# EAGLE design BackscatterPlantSensor_v4_trimmer (EAGLE 6.4)

## Sheet 1 of 3
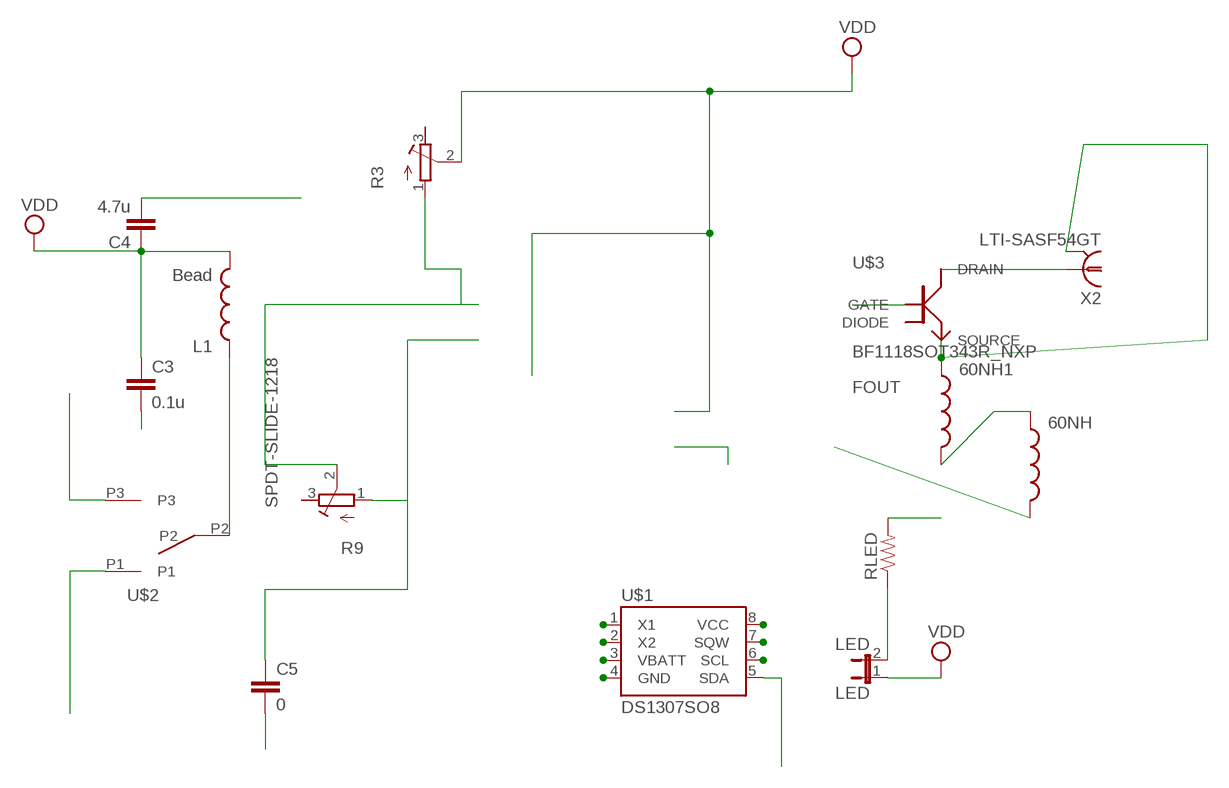
[diagram p0: schematic, sheet 1]

### Parts
60NH  INDUCTOR0402  [C0402]
60NH1  INDUCTOR0402  [C0402]
C3  0.1u  CAP0603-CAP  [0603-CAP]
C4  4.7u  CAP0805  [0805]
C5  0  CAP0603-CAP  [0603-CAP]
L1  Bead  INDUCTOR0402  [C0402]
LED  LED  JUMPER-2PTH_LOCK  [1X02_LOCK]
R3  R-TRIMM74W  [RTRIM74W]
R9  R-TRIMM74W  [RTRIM74W]
RLED  RESISTOR0805-RES  [0805]
U$1  DS1307SO8  [SO08]
U$2  SPDT-SLIDE-1218  [SPDT-SLIDE-1218]
U$3  BF1118SOT343R_NXP  [SOT343R]
X2  LTI-SASF54GT  [LTI-SASF54GT]

### Nets
DGND: C3.2 C4.2 C5.2 RLED.2 U$1.1(X1) U$3.1(GATE)
DRAIN: U$3.4(DRAIN) X2.1
FOUT: 60NH.2 U$1.3(VBATT)
FOUT2: 60NH1.1 U$3.3(SOURCE) X2.2(GND)
N$3: 60NH1.2 60NH.1
N$4: LED.2 RLED.1
N$7: U$2.P3
P6: C5.1 R9.1(E) U$1.2(X2) U$1.6(SCL)
P7: R3.1(E) R9.2(S) U$1.7(SQW)
POWER: U$2.P1 ; also sheet 2
POWEROUT: L1.1 U$2.P2 ; also sheet 2
VDD: C3.1 C4.1 L1.2 LED.1 R3.2(S) U$1.4(GND) U$1.8(VCC)
VOUT1: U$1.5(SDA) ; also sheet 2
Unconnected: R3.3(A) R9.3(A) U$3.2(DIODE)

## Sheet 2 of 3
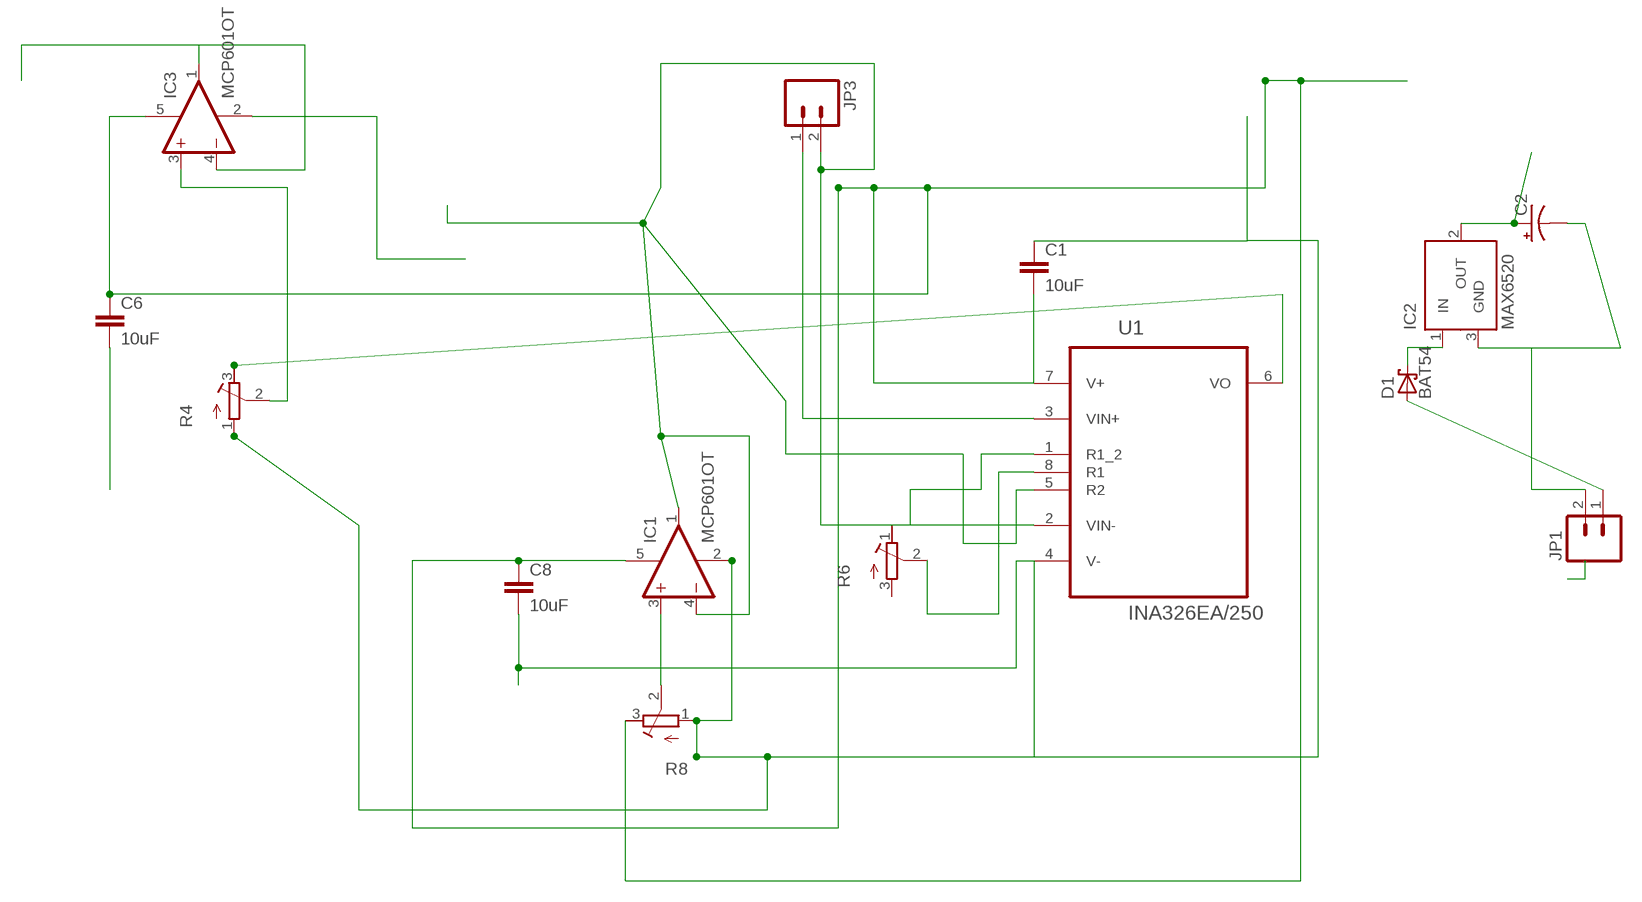
[diagram p1: schematic, sheet 2]

### Parts
C1  10uF  CAP0805  [0805]
C2  CAP_POLPTH1  [CPOL-RADIAL-100UF-25V]
C6  10uF  CAP0805  [0805]
C8  10uF  CAP0805  [0805]
D1  BAT54  [SOT23]
IC1  MCP601OT  [SOT23-5]
IC2  MAX6520  [SOT23]
IC3  MCP601OT  [SOT23-5]
JP1  M02PTH  [1X02]
JP3  M02PTH  [1X02]
R4  R-TRIMM74W  [RTRIM74W]
R6  R-TRIMM3314G  [RTRIM3314G]
R8  R-TRIMM74W  [RTRIM74W]
U1  INA326EA/250  [SOP65P490X110-8N]

### Nets
AGND: C1.1 C6.2 C8.2 IC1.2(V-) IC3.2(V-) R4.1(E) R8.1(E) U1.4(V-)
GND: C2.2(-) IC2.3(GND) JP1.2
IN: D1.3(K) IC2.1(IN)
N$10: IC1.3(+IN) R8.2(S)
N$21: JP3.1 U1.3(VIN+)
N$23: R6.2(S) U1.8(R1)
N$49: R6.1(E) U1.1(R1_2)
N$58: D1.1(A) JP1.1
POWER: C2.1(+) IC2.2(OUT) ; also sheet 1
POWEROUT: C1.2 C6.1 C8.1 IC1.5(V+) IC3.5(V+) R8.3(A) U1.7(V+) ; also sheet 1
VOUT1: IC3.1(OUT) IC3.4(-IN) ; also sheet 1
VOUT12: R4.3(A) U1.6(VO)
VOUT15: IC3.3(+IN) R4.2(S)
VREF: IC1.1(OUT) IC1.4(-IN) JP3.2 U1.2(VIN-) U1.5(R2)
Unconnected: R6.3(A)

## Sheet 3 of 3

## Power pins joined to a net without a drawn wire
GND: X2.3(GND) X2.4(GND) X2.5(GND)

## Library data of the parts
60NH 60NH1 = SparkFun:INDUCTOR: Inductors Basic Inductor/Choke - 0603 and 1206. Footprints are not proven and vary greatly between part numbers.
C1 C6 C8 = SparkFun-Passives:CAP: Capacitor Standard 0603 ceramic capacitor, and 0.1" leaded capacitor.
C2 = SparkFun:CAP_POL: Capacitor Polarized These are standard SMD and PTH capacitors. Normally 10uF, 47uF, and 100uF in electrolytic and tantalum varieties. Always verify the external diameter of the through hole cap, it varies with capacity, voltage, and manufacturer. The EIA devices should be standard.
C3-C5 = SparkFun-Capacitors:CAP: Capacitor Standard 0603 ceramic capacitor, and 0.1" leaded capacitor.
D1 = nxp_60:BAT54: Schottky barrier diode Planar Schottky barrier diode encapsulated in small plastic SMD packages. Single diodes and double diodes with different pinning are available AAL Eindhoven MK
IC1 IC3 = linear:MCP601: Single Op Amp 2.7V to 6.0V Single Supply CMOS Source: http://ww1.microchip.com/downloads/en/DeviceDoc/21314g.pdf
IC2 = maxim:MAX6520: 1.2V Voltage Reference 50ppm/°C, SOT23, 3-Terminal Source: Data sheet <http://datasheets.maxim-ic.com/en/ds/MAX6520.pdf>; MF: MAXIM; MPN: MAX6520EUR-T; OC_FARNELL: unknown; OC_NEWARK: 02J4586
JP1 JP3 = SparkFun-Connectors:M02: Header 2 Standard 2-pin 0.1" header. Use with straight break away headers (SKU : PRT-00116), right angle break away headers (PRT-00553), swiss pins (PRT-00743), machine pins (PRT-00117), and female headers (PRT-00115). Molex polarized connector foot print use with SKU : PRT-08233 with associated crimp pins and housings.
L1 = SparkFun-Passives:INDUCTOR: Inductors Basic Inductor/Choke - 0603 and 1206. Footprints are not proven and vary greatly between part numbers.
LED = SparkFun-Passives:JUMPER-2: Jumper Basic 0.1" spaced jumper. Use with breakaway headers.
R3 R4 R8 R9 = resistor:R-TRIMM: Trimm resistor
R6 = rcl:R-TRIMM: Trimm resistor
RLED = SparkFun-Resistors:RESISTOR: Resistor Basic schematic elements and footprints for 0603, 1206, and PTH resistors.
U1 = Texas Instruments_By_element14_Batch_1:INA326EA/250: Precision, Rail-to-Rail I/O INSTRUMENTATION AMPLIFIER; MPN: INA326EA/250; OC_FARNELL: 1218192; OC_NEWARK: 74K3817; PACKAGE: MSOP-8; SUPPLIER: Texas Instruments
U$1 = SparkFun-FreqCtrl:DS1307: I2C real-time clock with battery backup.
U$2 = iCube_library:SPDT-SLIDE-1218
U$3 = rf_transistors:BF1118
X2 = con-coax:LTI-SASF54GT: SMA vertical PCB thrue hole jack Source: Lighthorse Technologies, inc. SASF54GT.pdf; OC_FARNELL: unknown; OC_NEWARK: unknown

## Board
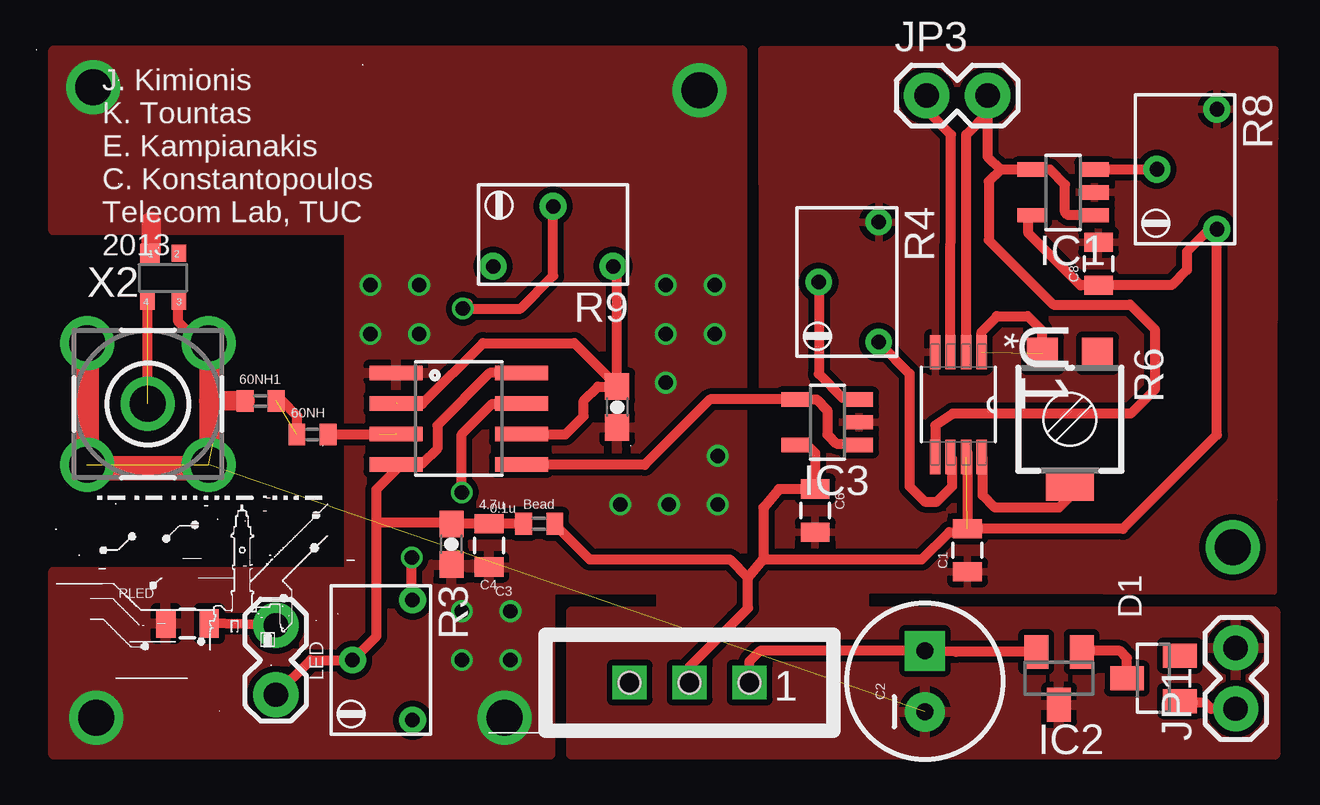
[diagram p2: board, top side]
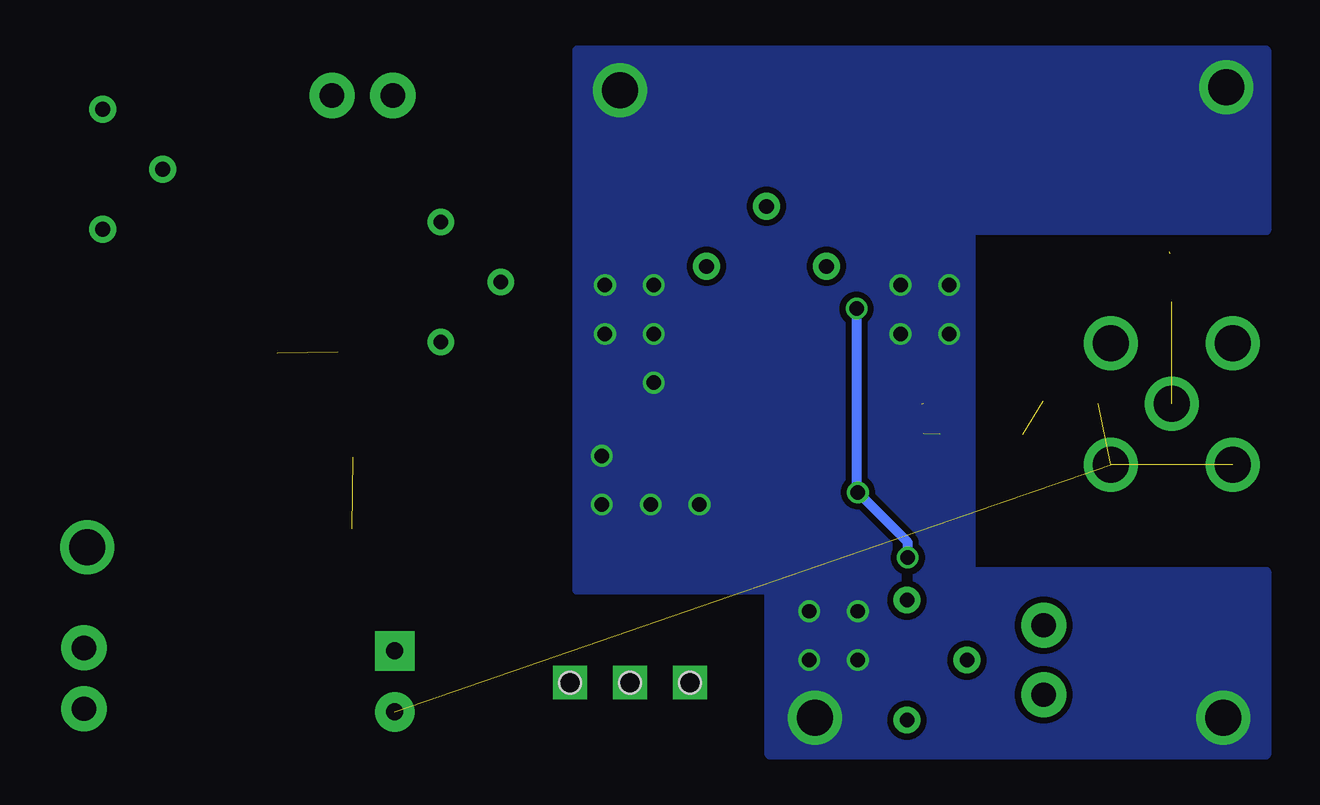
[diagram p3: board, bottom side, seen from below]

No outline drawn. Coordinates in mm, seen from the top.
Copper layers (1*16): Top 0.035mm / dielectric 1.5mm / Bottom 0.035mm
Design rules "Fusion_eagle_rule_v1.1 *": minimum track width 6mil, minimum drill 12mil, track to track 10mil, track to pad 10mil, pad to pad 10mil, via to via 10mil, smd to smd 0mil, copper to edge 10mil, drill to drill 10mil, minimum pad ring 10mil, minimum via ring 6mil, stop-mask expansion 2mil, vias tented up to drill 100mil, thermal gap 10mil

### Footprints (pad centres in the part's own frame; a part is rotated, then mirrored left to right if it is on the bottom)
C0402 = smd 0.7 x 0.9: 1 -0.65,0; 2 0.65,0
0805 = smd 0.8 x 1.2: 1 -0.9,0; 2 0.9,0
CPOL-RADIAL-100UF-25V = drill 0.7 pad 1.651 square: 1 1.27,0 | drill 0.7 pad 1.651: 2 -1.27,0
0603-CAP = smd 1.1 x 1: 1 -0.85,0; 2 0.85,0
SOT23 = smd 1 x 1.4: 1 -0.95,-1.1; 2 0.95,-1.1; 3 0,1.1
SOT23-5 = smd 0.6 x 1.2: 1 -0.95,-1.306; 2 0,-1.306; 3 0.95,-1.306; 4 0.95,1.306; 5 -0.95,1.306
1X02 = drill 1.016 pad 1.88: 1 0,0; 2 2.54,0
1X02_LOCK = drill 1.016 pad 1.88: 1 -0.178,0; 2 2.718,0
RTRIM74W = drill 0.61: 1 -1.25,-2.5; 2 1.25,0; 3 -1.25,2.5
RTRIM3314G = smd 1.3 x 1.3: 1 1.15,-2.75; 3 -1.15,-2.75 | smd 2 x 1.3: 2 0,2.75
SOP65P490X110-8N = smd 1.422 x 0.432: 1 -2.184,0.965; 2 -2.184,0.33; 3 -2.184,-0.33; 4 -2.184,-0.965; 5 2.184,-0.965; 6 2.184,-0.33; 7 2.184,0.33; 8 2.184,0.965
SO08 = smd 0.61 x 2.21: 1 -1.905,-2.616; 2 -0.635,-2.616; 3 0.635,-2.616; 4 1.905,-2.616; 5 1.905,2.616; 6 0.635,2.616; 7 -0.635,2.616; 8 -1.905,2.616
SPDT-SLIDE-1218 = drill 0.9 square: P1 -2.5,0; P2 0,0; P3 2.5,0 | hole 0.9: -2.5,0; 0,0; 2.5,0
SOT343R = smd 0.8 x 0.8: 1 0.55,-1.07 | smd 0.6 x 0.7: 2 -0.66,-1.07; 3 -0.66,0.94; 4 0.65,0.94
LTI-SASF54GT = drill 1.5 pad 2.2: 1 0,0; 2 -2.54,2.54; 3 2.54,2.54; 4 2.54,-2.54; 5 -2.54,-2.54

### Placement (x,y rotation side)
60NH  11.81,10.41 0 top
60NH1  9.65,11.81 0 top
C1  39.12,5.59 90 top
C2  37.34,0.13 90 top
C3  17.6,5.84 270 top
C4  19.18,5.79 270 top
C5  24.51,11.56 270 top
C6  32.77,7.24 270 top
C8  44.58,17.53 90 top
D1  46.86,0.25 90 top
IC1  43.1,20.5 90 top
IC2  42.93,0.25 180 top
IC3  33.27,10.92 90 top
JP1  50.29,-1.02 90 top
JP3  37.41,24.54 0 top
L1  21.26,6.69 180 top
LED  10.29,-0.25 90 top
R3  14.73,1.02 180 top
R4  34.16,16.76 180 top
R6  43.38,11.05 180 top
R8  48.26,21.46 180 top
R9  21.84,18.67 90 top
RLED  6.6,2.54 180 top
U1  38.73,11.66 270 top
U$1  17.91,11.07 270 top
U$2  27.53,0.08 180 top
U$3  5.59,16.89 180 top
X2  4.95,11.68 0 top

### Tracks (layer width: path | path; a pad name or v marks a point on that pad's centre or on a via)
AGND
  pour Top: 30.56,26.44 51.92,26.44 51.87,3.89 30.58,3.94
DGND  (via drill 0.6, 1.5)  (1 unrouted)
  Top 0.813: 5.08,18.03 5.08,19.3
  other vias: 24.64,7.49 18.03,3.05 2.67,24.89 27.94,24.77 19.81,-1.4 2.79,-1.4 28.7,9.53 26.67,7.49 20.07,3.05 18.03,1.02 20.07,1.02 28.7,7.49 26.54,12.57 26.54,14.61 28.57,14.61 16.26,14.61 14.22,14.61 16.26,16.64 14.22,16.64 26.54,16.64 28.57,16.64
  pour Top: 1.02,26.42 29.72,26.42 29.72,3.94 21.72,3.94 21.72,-2.92 1.02,-2.92 1.02,4.7 13.34,4.7 13.34,18.92 1.02,18.92
  pour Bottom: 1.02,18.92 13.34,18.92 13.34,4.7 1.02,4.7 1.02,-2.92 21.72,-2.92 21.72,3.94 29.72,3.94 29.72,26.42 1.02,26.42
DRAIN  (1 unrouted)
FOUT  (1 unrouted)
  Top 0.406: 60NH.2 14.61,10.41
FOUT2
  Top 0.305: U$3.3 6.25,15.6 | 60NH1.1 8.13,11.81 7.62,12.32
  Top 0.406: 7.62,14.22 7.11,14.22 6.22,15.11 6.22,15.93 U$3.3
  Top 1.016: X2.2 2.41,9.02 7.62,9.02 7.62,12.32 7.62,14.22
GND  (3 unrouted)
  Top 0.305: X2.3 7.49,12.19 8,11.68
  pour Top: 22.61,3.05 51.94,3.05 51.94,-2.92 22.61,-2.92
IN
  Top 0.406: D1.3 45.76,1.1 45.47,1.4 44.05,1.4 IC2.1
N$3  (1 unrouted)
N$4
  Top 0.406: LED.2 RLED.1
N$6
  pour Top: 29.34,4.19 29.34,3.43 28.83,2.92 26.29,2.92 26.29,4.45 29.08,4.45
N$8
  pour Top: 30.61,4.19 34.8,4.19 34.8,3.05 30.61,3.05
N$10
  Top 0.406: R8.2 46.99,21.45 IC1.3
N$20  (via drill 1.5)
  other vias: 50.16,5.71
N$21
  Top 0.406: U1.3 38.43,22.91 37.41,23.93 JP3.1
N$23
  Top 0.406: R6.2 43.38,7.82 42.93,7.37 40.26,7.37 39.75,7.87 39.75,9.42 U1.8
N$49  (1 unrouted)
N$52
  Top 0.305: 42.16,14.33 42.24,14.25
N$53
  Top 0.305: 42.95,8.69 43,8.74
N$57
  Top 0.406: 11.18,10.41 11.18,11.18 10.54,11.81 10.41,11.81
N$58
  Top 0.406: JP1.1 49.28,-1.02 49.02,-0.76 48.03,-0.76 D1.1
N$84  (via drill 0.6)
  other vias: 18.03,8
N$87
  Top 0.813: 9.02,11.81 7.49,11.81
N$97
  Top 0.406: 39.7,13.74 39.7,14.68 40.36,15.34
N$98
  Top 0.406: 40.34,15.34 41.63,15.34 42.22,14.76 42.22,13.89 42.19,13.87
N$99
  Top 0.406: 4.95,11.56 4.95,16
N$100
  Top 0.406: 39.12,9.65 39.12,6.48
N$113
  Top 0.406: 18.29,15.88 18.03,15.62
P6  (1 unrouted)
  Top 0.406: 24.3,12.19 C5.1 | 15.37,11.68 16.38,11.68 18.92,14.22 22.73,14.22 24.51,12.45 C5.1 | U$1.6 20.55,10.41 22.35,10.41 23.11,11.18 23.11,11.81 23.71,12.41 C5.1 | C5.1 24.51,17.25 R9.1
P7  (via drill 0.6, 0.6 pad 0.3)
  Top 0.406: v18.03,8 18.03,10.41 19.3,11.68 20.5,11.68 U$1.7 | v18.09,15.66 20.48,15.66 21.84,17.02 R9.2 | R3.1 15.95,3.55 v15.95,5.28
  Bottom 0.406: v15.95,5.28 15.95,5.92 v18.03,8 18.09,8.05 v18.09,15.66
POWER
  Top 0.406: IC2.2 38.65,1.35 C2.1 30.46,1.4 30.03,0.96 U$2.P1
POWEROUT  (1 unrouted)
  Top 0.406: IC1.5 41.66,19.41 41.66,18.8 43.83,16.63 C8.1 47.62,16.64 48.26,17.27 48.26,18.03 49.19,18.96 R8.3 49.51,10.39 45.59,6.48 39.13,6.48 C1.2 38.98,6.35 38.35,6.35 37.21,5.21 30.61,5.21 | U$2.P2 27.53,0.74 29.97,3.17 29.97,4.45 | 29.97,4.45 30.61,5.21 | L1.1 21.91,6.67 23.37,5.21 29.21,5.21 29.97,4.45 | 30.61,5.21 30.61,7.37 31.25,8.14 C6.1 32.77,9.65 32.45,9.97 IC3.5
VDD
  Top 0.152: 16.36,9.25 16.39,9.2 U$1.4
  Top 0.406: U$1.8 19.2,12.98 17.02,10.79 17.02,9.83 16.39,9.2 | 14.48,6.73 14.48,2.01 R3.2 11.73,1.02 LED.1 | 14.48,6.73 14.48,8.13 15.29,8.94 U$1.4 | L1.2 C4.1 C3.1 17.51,6.73 14.48,6.73
VOUT1
  Top 0.406: U$1.5 20.55,9.14 25.65,9.14 28.38,11.87 IC3.4 32.83,11.87 33.27,11.43 33.27,10.41 33.66,10.03 34.52,10.03 IC3.1
VOUT12
  Top 0.406: R4.3 35.41,14.24 36.7,12.95 36.7,8.26 37.34,7.62 37.85,7.62 38.48,8.26 38.48,9.4 U1.6
VOUT15
  Top 0.406: R4.2 32.91,12.93 33.91,11.94 34.51,11.94 IC3.3
VREF
  Top 0.406: U1.5 37.77,10.79 38.51,11.28 45.92,11.28 46.91,12.27 46.91,14.81 45.9,15.82 42.7,15.82 40.01,18.52 40.01,20.95 40.5,21.45 | 41.78,21.46 IC1.4 | IC1.4 40.5,21.45 | IC1.1 43.31,19.56 43.18,19.68 43.18,20.83 42.56,21.45 IC1.4 | U1.2 39.06,22.91 39.95,23.8 | JP3.2 39.95,23.8 | 39.95,23.8 39.95,21.99 40.5,21.45

### Text on the board
tPlace: J. Kimionis / K. Tountas / E. Kampianakis / C. Konstantopoulos / Telecom Lab, TUC / 2013